# Altium schematic sheet Microcontrolador.SchDoc
size A4; SheetNumber: 4; SheetTotal: 5
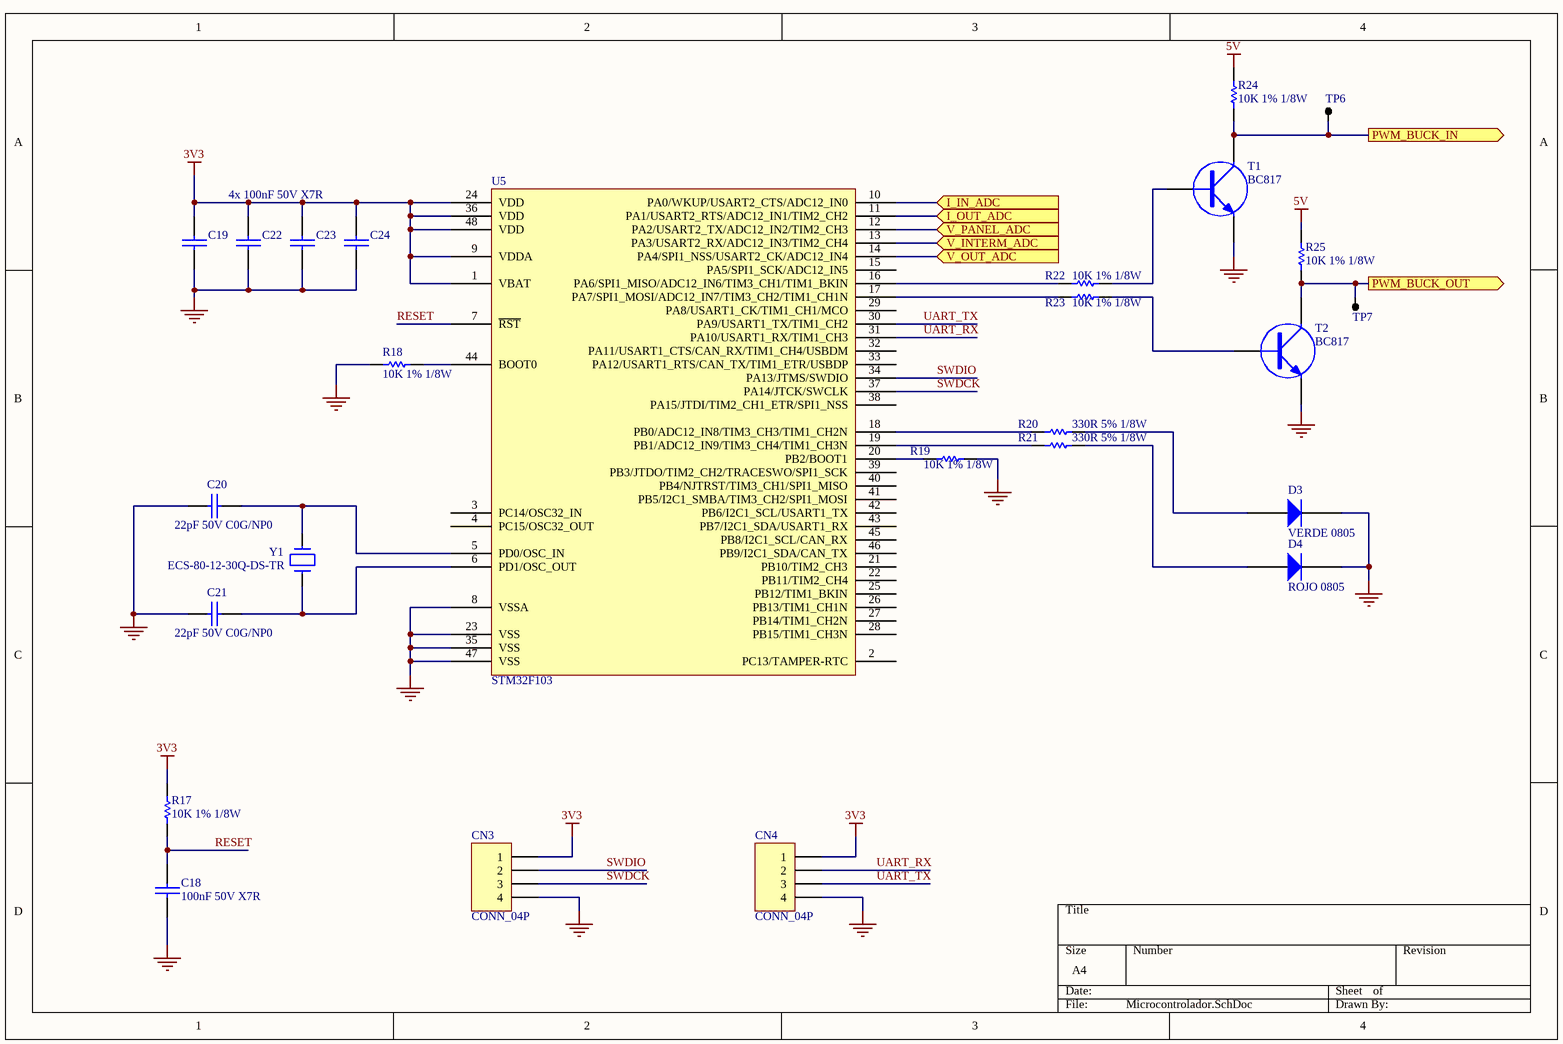
[diagram p0: Microcontrolador.SchDoc]

## Parts
C18  100nF 50V X7R  [0805]
C19  100nF 50V X7R  [0805]  (value not drawn)
C20  22pF 50V C0G/NP0  [0805]
C21  22pF 50V C0G/NP0  [0805]
C22  100nF 50V X7R  [0805]  (value not drawn)
C23  100nF 50V X7R  [0805]  (value not drawn)
C24  100nF 50V X7R  [0805]  (value not drawn)
CN3  CONN_04P  [MOLEX4 - 0.1"]
CN4  CONN_04P  [MOLEX4 - 0.1"]
D3  VERDE 0805  [LED0805]
D4  ROJO 0805  [LED0805]
R17  10K 1% 1/8W  [0805]
R18  10K 1% 1/8W  [0805]
R19  10K 1% 1/8W  [0805]
R20  330R 5% 1/8W  [0805]
R21  330R 5% 1/8W  [0805]
R22  10K 1% 1/8W  [0805]
R23  10K 1% 1/8W  [0805]
R24  10K 1% 1/8W  [0805]
R25  10K 1% 1/8W  [0805]
T1  BC817  [SOT23]
T2  BC817  [SOT23]
TP6  TP  [TP_COMPACT]  (value not drawn)
TP7  TP  [TP_COMPACT]  (value not drawn)
U5  STM32F103  [LQFP48 - 7x7]
Y1  ECS-80-12-30Q-DS-TR  [ECS 2-SMD]

## Ports
I_IN_ADC (in, see MainSCH[2C], Filtros[2B]), I_OUT_ADC (in, see MainSCH[2C], Filtros[2D]), PWM_BUCK_IN (out, see MainSCH[2C], Bucks[2B]), PWM_BUCK_OUT (out, see MainSCH[2C], Bucks[1C]), V_INTERM_ADC (in, see MainSCH[2D], Filtros[3D]), V_OUT_ADC (in, see MainSCH[2D], Filtros[4B]), V_PANEL_ADC (in, see MainSCH[2D], Filtros[3B])

## Nets
3V3: C19.2 C22.2 C23.2 C24.2 CN3.1 CN4.1 R17.2 U5.1(VBAT) U5.9(VDDA) U5.24(VDD) U5.36(VDD) U5.48(VDD)
5V: R24.2 R25.2
GND: C18.1 C19.1 C20.2 C21.2 C22.1 C23.1 C24.1 CN3.4 CN4.4 D3.K D4.K R18.1 R19.2 T1.3(E) T2.3(E) U5.8(VSSA) U5.23(VSS) U5.35(VSS) U5.47(VSS)
I_IN_ADC: U5.10(PA0/WKUP/USART2_CTS/ADC12_IN0) ; port I_IN_ADC
I_OUT_ADC: U5.11(PA1/USART2_RTS/ADC12_IN1/TIM2_CH2) ; port I_OUT_ADC
PWM_BUCK_IN: R24.1 T1.2(C) TP6.1 ; port PWM_BUCK_IN
PWM_BUCK_OUT: R25.1 T2.2(C) TP7.1 ; port PWM_BUCK_OUT
RESET: C18.2 R17.1 U5.7(~{RST})
SWDCK: CN3.3 U5.37(PA14/JTCK/SWCLK)
SWDIO: CN3.2 U5.34(PA13/JTMS/SWDIO)
UART_RX: CN4.2 U5.31(PA10/USART1_RX/TIM1_CH3)
UART_TX: CN4.3 U5.30(PA9/USART1_TX/TIM1_CH2)
V_INTERM_ADC: U5.13(PA3/USART2_RX/ADC12_IN3/TIM2_CH4) ; port V_INTERM_ADC
V_OUT_ADC: U5.14(PA4/SPI1_NSS/USART2_CK/ADC12_IN4) ; port V_OUT_ADC
V_PANEL_ADC: U5.12(PA2/USART2_TX/ADC12_IN2/TIM2_CH3) ; port V_PANEL_ADC
NetC20_1: C20.1 U5.5(PD0/OSC_IN) Y1.2
NetC21_1: C21.1 U5.6(PD1/OSC_OUT) Y1.1
NetD3_A: D3.A R20.2
NetD4_A: D4.A R21.2
NetR18_2: R18.2 U5.44(BOOT0)
NetR19_1: R19.1 U5.20(PB2/BOOT1)
NetR20_1: R20.1 U5.18(PB0/ADC12_IN8/TIM3_CH3/TIM1_CH2N)
NetR21_1: R21.1 U5.19(PB1/ADC12_IN9/TIM3_CH4/TIM1_CH3N)
NetR22_1: R22.1 U5.16(PA6/SPI1_MISO/ADC12_IN6/TIM3_CH1/TIM1_BKIN)
NetR22_2: R22.2 T1.1(B)
NetR23_1: R23.1 U5.17(PA7/SPI1_MOSI/ADC12_IN7/TIM3_CH2/TIM1_CH1N)
NetR23_2: R23.2 T2.1(B)

Not connected (* = marked no-connect by the designer): U5 2(PC13/TAMPER-RTC) 3(PC14/OSC32_IN) 4(PC15/OSC32_OUT) 15(PA5/SPI1_SCK/ADC12_IN5) 21(PB10/TIM2_CH3) 22(PB11/TIM2_CH4) 25(PB12/TIM1_BKIN) 26(PB13/TIM1_CH1N) 27(PB14/TIM1_CH2N) 28(PB15/TIM1_CH3N) 29(PA8/USART1_CK/TIM1_CH1/MCO) 32(PA11/USART1_CTS/CAN_RX/TIM1_CH4/USBDM) 33(PA12/USART1_RTS/CAN_TX/TIM1_ETR/USBDP) 38(PA15/JTDI/TIM2_CH1_ETR/SPI1_NSS) 39(PB3/JTDO/TIM2_CH2/TRACESWO/SPI1_SCK) 40(PB4/NJTRST/TIM3_CH1/SPI1_MISO) 41(PB5/I2C1_SMBA/TIM3_CH2/SPI1_MOSI) 42(PB6/I2C1_SCL/USART1_TX) 43(PB7/I2C1_SDA/USART1_RX) 45(PB8/I2C1_SCL/CAN_RX) 46(PB9/I2C1_SDA/CAN_TX)

## Notes on the sheet
- 4x 100nF 50V X7R

## Library data of the parts
C18-C24 = CAP
CN3 CN4 = CONN_04P: Connector Generic 4 Vias
D3 D4 = Led
R17-R25 = RES
T1 T2 = TRANSISTOR NPN
Y1 = CRISTAL